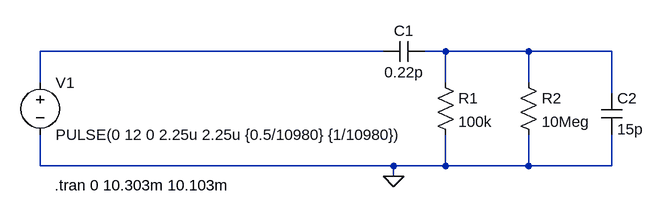
[diagram p0: schematic HIPSU simulation.asc]
HIPSU simulation.asc, the LTspice schematic file:
Version 4
SHEET 1 880 680
WIRE 192 96 -336 96
WIRE 288 96 256 96
WIRE 416 96 288 96
WIRE 544 96 416 96
WIRE -336 144 -336 96
WIRE 288 144 288 96
WIRE 416 144 416 96
WIRE 544 160 544 96
WIRE -336 272 -336 224
WIRE 208 272 -336 272
WIRE 288 272 288 224
WIRE 288 272 208 272
WIRE 416 272 416 224
WIRE 416 272 288 272
WIRE 544 272 544 224
WIRE 544 272 416 272
WIRE 208 288 208 272
FLAG 208 288 0
SYMBOL voltage -336 128 R0
WINDOW 123 0 0 Left 0
WINDOW 39 0 0 Left 0
SYMATTR InstName V1
SYMATTR Value PULSE(0 12 0 2.25u 2.25u {0.5/10980} {1/10980})
SYMBOL cap 256 80 R90
WINDOW 0 0 32 VBottom 2
WINDOW 3 32 32 VTop 2
SYMATTR InstName C1
SYMATTR Value 0.22p
SYMBOL res 272 128 R0
SYMATTR InstName R1
SYMATTR Value 100k
SYMBOL res 400 128 R0
SYMATTR InstName R2
SYMATTR Value 10Meg
SYMBOL cap 528 160 R0
SYMATTR InstName C2
SYMATTR Value 15p
TEXT -314 302 Left 2 !.tran 0 10.303m 10.103m

The netlist it stands for:
* HIPSU simulation.asc
V1 N001 0 PULSE(0 12 0 2.25u 2.25u {0.5/10980} {1/10980})
C1 N002 N001 0.22p
R1 N002 0 100k
R2 N002 0 10Meg
C2 N002 0 15p
.tran 0 10.303m 10.103m
.backanno
.end